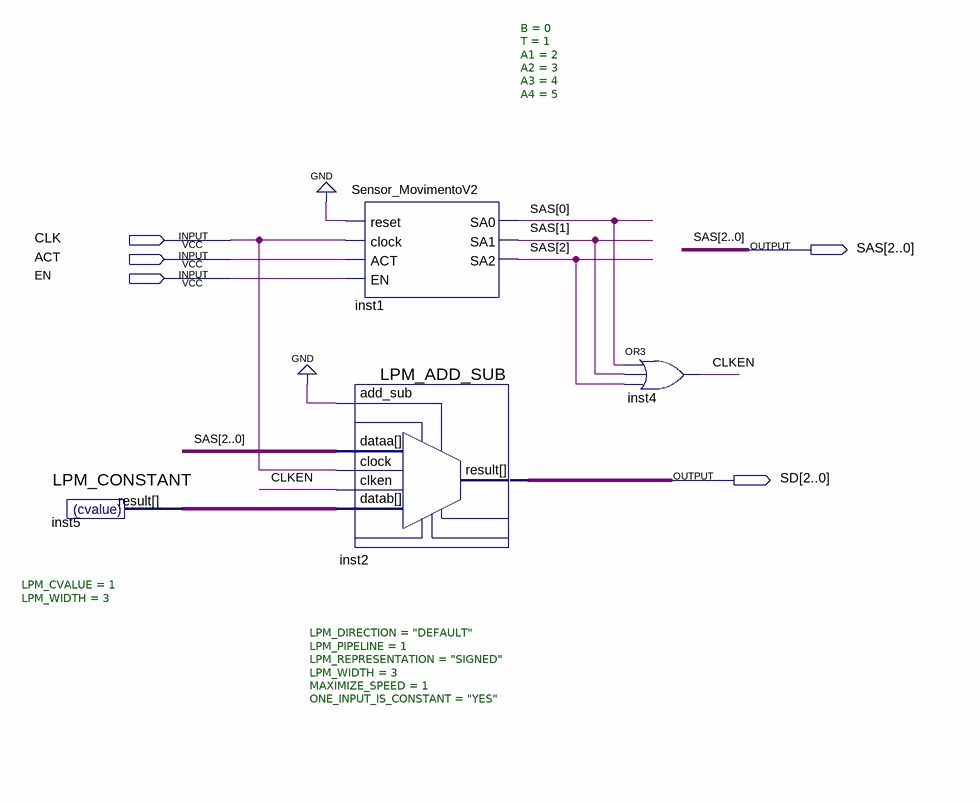
[diagram p0: schematic sheet]
// Quartus schematic Elevador_MovimentoV2.bdf as structural Verilog: 4 symbols, 5 pins
module Elevador_MovimentoV2 (
  input  CLK,
  input  ACT,
  input  EN,
  output [2:0] SAS,
  output [2:0] SD
);

  wire CLKEN;
  wire [2:0] inst5_result;

  LPM_CONSTANT #(.LPM_CVALUE(1), .LPM_WIDTH(3)) inst5 (.result(inst5_result));
  Sensor_MovimentoV2 #(.B(0), .T(1), .A1(2), .A2(3), .A3(4), .A4(5)) inst1 (
    .reset(1'b0), .clock(CLK), .ACT(ACT), .EN(EN), .SA0(SAS[0]), .SA1(SAS[1]), .SA2(SAS[2]));
  LPM_ADD_SUB #(.LPM_DIRECTION("DEFAULT"), .LPM_PIPELINE(1), .LPM_REPRESENTATION("SIGNED"), .LPM_WIDTH(3), .MAXIMIZE_SPEED(1), .ONE_INPUT_IS_CONSTANT("YES")) inst2 (
    .add_sub(1'b0), .clken(CLKEN), .clock(CLK), .dataa(SAS), .datab(inst5_result), .result(SD));
  or inst4 (CLKEN, SAS[0], SAS[1], SAS[2]);
endmodule
